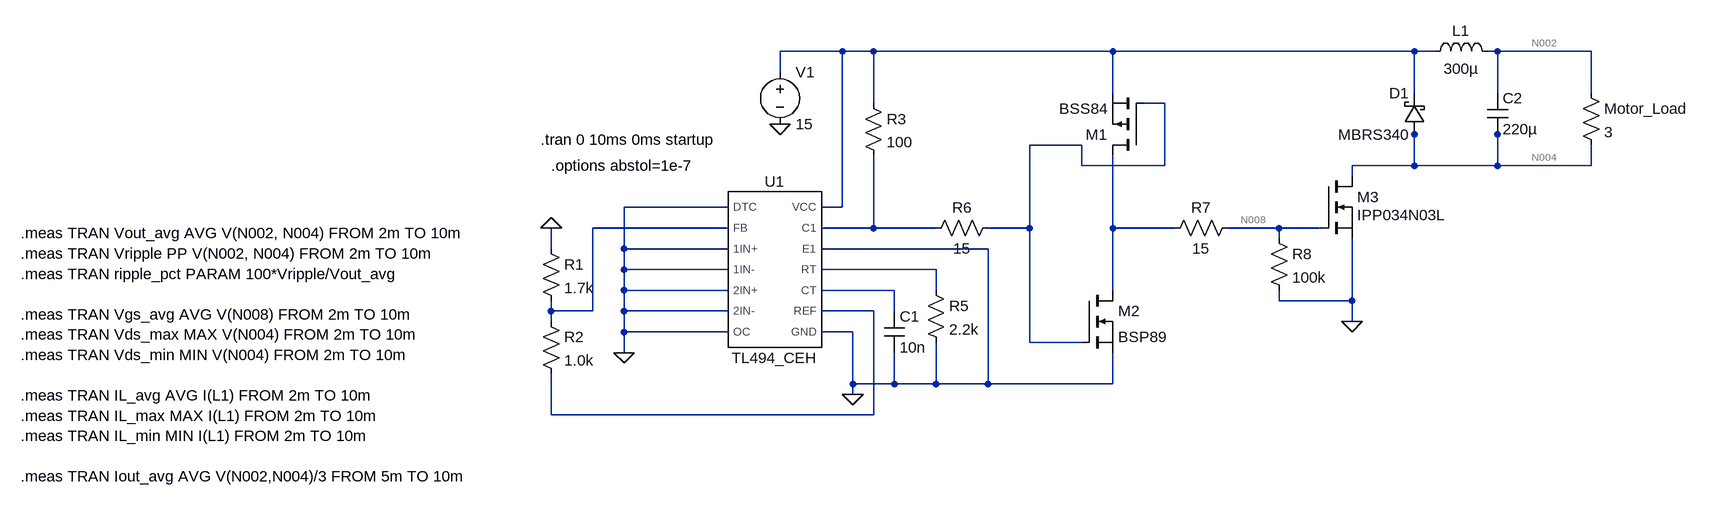
[diagram p0: schematic Solar_Car_Simulation.asc]
Solar_Car_Simulation.asc, the LTspice schematic file:
Version 4.1
SHEET 1 1684 728
WIRE 368 -224 272 -224
WIRE 416 -224 368 -224
WIRE 784 -224 416 -224
WIRE 1248 -224 784 -224
WIRE 1280 -224 1248 -224
WIRE 1376 -224 1360 -224
WIRE 1520 -224 1376 -224
WIRE 272 -192 272 -224
WIRE 784 -160 784 -224
WIRE 1248 -160 1248 -224
WIRE 1376 -160 1376 -224
WIRE 1520 -160 1520 -224
WIRE 416 -144 416 -224
WIRE 864 -144 832 -144
WIRE 1248 -96 1248 -112
WIRE 1376 -96 1376 -112
WIRE 736 -80 656 -80
WIRE 736 -48 736 -80
WIRE 864 -48 864 -144
WIRE 864 -48 736 -48
WIRE 1248 -48 1248 -96
WIRE 1248 -48 1152 -48
WIRE 1376 -48 1376 -96
WIRE 1376 -48 1248 -48
WIRE 1520 -48 1520 -80
WIRE 1520 -48 1376 -48
WIRE 1152 -32 1152 -48
WIRE 192 16 32 16
WIRE 368 16 368 -224
WIRE 368 16 336 16
WIRE 192 48 -16 48
WIRE 416 48 416 -64
WIRE 416 48 336 48
WIRE 512 48 416 48
WIRE 656 48 656 -80
WIRE 656 48 592 48
WIRE 784 48 784 -64
WIRE 880 48 784 48
WIRE 1040 48 960 48
WIRE 1104 48 1040 48
WIRE 1040 64 1040 48
WIRE -80 80 -80 48
WIRE 32 80 32 16
WIRE 192 80 32 80
WIRE 592 80 336 80
WIRE 32 112 32 80
WIRE 192 112 32 112
WIRE 512 112 336 112
WIRE 32 144 32 112
WIRE 192 144 32 144
WIRE 448 144 336 144
WIRE 512 144 512 112
WIRE 784 144 784 48
WIRE 1040 160 1040 144
WIRE 1152 160 1152 64
WIRE 1152 160 1040 160
WIRE -80 176 -80 160
WIRE -16 176 -16 48
WIRE -16 176 -80 176
WIRE 32 176 32 144
WIRE 192 176 32 176
WIRE 416 176 336 176
WIRE 448 176 448 144
WIRE -80 192 -80 176
WIRE 1152 192 1152 160
WIRE 32 208 32 176
WIRE 192 208 32 208
WIRE 384 208 336 208
WIRE 656 224 656 48
WIRE 736 224 656 224
WIRE 32 240 32 208
WIRE 384 288 384 208
WIRE 448 288 448 240
WIRE 448 288 384 288
WIRE 512 288 512 224
WIRE 512 288 448 288
WIRE 592 288 592 80
WIRE 592 288 512 288
WIRE 784 288 784 240
WIRE 784 288 592 288
WIRE 384 304 384 288
WIRE -80 336 -80 272
WIRE 416 336 416 176
WIRE 416 336 -80 336
FLAG -80 48 0
FLAG 272 -112 0
FLAG 384 304 0
FLAG 32 240 0
FLAG 1152 192 0
SYMBOL res -96 64 R0
SYMATTR InstName R1
SYMATTR Value 1.7k
SYMBOL res -96 176 R0
SYMATTR InstName R2
SYMATTR Value 1.0k
SYMBOL res 496 128 R0
SYMATTR InstName R5
SYMATTR Value 2.2k
SYMBOL cap 432 176 R0
SYMATTR InstName C1
SYMATTR Value 10n
SYMBOL voltage 272 -208 R0
WINDOW 123 0 0 Left 2
WINDOW 39 0 0 Left 2
SYMATTR InstName V1
SYMATTR Value 15
SYMBOL res 400 -160 R0
SYMATTR InstName R3
SYMATTR Value 100
SYMBOL res 608 32 R90
WINDOW 0 0 56 VBottom 2
WINDOW 3 32 56 VTop 2
SYMATTR InstName R6
SYMATTR Value 15
SYMBOL pmos 832 -64 R180
SYMATTR InstName M1
SYMATTR Value BSS84
SYMBOL nmos 736 144 R0
SYMATTR InstName M2
SYMATTR Value BSP89
SYMBOL res 976 32 R90
WINDOW 0 0 56 VBottom 2
WINDOW 3 32 56 VTop 2
SYMATTR InstName R7
SYMATTR Value 15
SYMBOL nmos 1104 -32 R0
WINDOW 3 56 60 Left 2
SYMATTR Value IPP034N03L
SYMATTR InstName M3
SYMBOL res 1024 48 R0
SYMATTR InstName R8
SYMATTR Value 100k
SYMBOL schottky 1264 -96 R180
WINDOW 0 24 64 Left 2
WINDOW 3 24 0 Left 2
SYMATTR InstName D1
SYMATTR Value MBRS340
SYMATTR Description Diode
SYMATTR Type diode
SYMBOL cap 1360 -160 R0
SYMATTR InstName C2
SYMATTR Value 220µ
SYMBOL ind 1264 -208 R270
WINDOW 0 32 56 VTop 2
WINDOW 3 5 56 VBottom 2
SYMATTR InstName L1
SYMATTR Value 300µ
SYMATTR SpiceLine Rser=1m
SYMBOL res 1504 -176 R0
SYMATTR InstName Motor_Load
SYMATTR Value 3
SYMBOL TL494_CEH 256 112 R0
SYMATTR InstName U1
TEXT -96 -88 Left 2 !.tran 0 10ms 0ms startup
TEXT -80 -48 Left 2 !.options abstol=1e-7
TEXT -896 56 Left 2 !.meas TRAN Vout_avg AVG V(N002, N004) FROM 2m TO 10m\n.meas TRAN Vripple PP V(N002, N004) FROM 2m TO 10m\n.meas TRAN ripple_pct PARAM 100*Vripple/Vout_avg\n \n.meas TRAN Vgs_avg AVG V(N008) FROM 2m TO 10m\n.meas TRAN Vds_max MAX V(N004) FROM 2m TO 10m\n.meas TRAN Vds_min MIN V(N004) FROM 2m TO 10m\n \n.meas TRAN IL_avg AVG I(L1) FROM 2m TO 10m\n.meas TRAN IL_max MAX I(L1) FROM 2m TO 10m\n.meas TRAN IL_min MIN I(L1) FROM 2m TO 10m\n \n.meas TRAN Iout_avg AVG V(N002,N004)/3 FROM 5m TO 10m

The netlist it stands for:
* Solar_Car_Simulation.asc
R1 0 N005 1.7k
R2 N005 N011 1.0k
R5 N009 0 2.2k
C1 N010 0 10n
V1 N001 0 15
R3 N001 N006 100
R6 N003 N006 15
M1 N007 N003 N001 N001 BSS84
M2 N007 N003 0 0 BSP89
R7 N008 N007 15
M3 N004 N008 0 0 IPP034N03L
R8 N008 0 100k
D1 N004 N001 MBRS340
C2 N002 N004 220µ
L1 N001 N002 300µ Rser=1m
R§Motor_Load N002 N004 3
X§U1 0 N005 0 0 0 0 0 N001 N006 0 N009 N010 N011 0 TL494_CEH  ; pins DTC FB 1IN+ 1IN- 2IN+ 2IN- OC VCC C1 E1 RT CT REF GND
.model D D
.lib standard.dio
.model NMOS NMOS
.model PMOS PMOS
.lib standard.mos
.tran 0 10ms 0ms startup
.options abstol=1e-7
.meas TRAN Vout_avg AVG V(N002, N004) FROM 2m TO 10m
.meas TRAN Vripple PP V(N002, N004) FROM 2m TO 10m
.meas TRAN ripple_pct PARAM 100*Vripple/Vout_avg
.meas TRAN Vgs_avg AVG V(N008) FROM 2m TO 10m
.meas TRAN Vds_max MAX V(N004) FROM 2m TO 10m
.meas TRAN Vds_min MIN V(N004) FROM 2m TO 10m
.meas TRAN IL_avg AVG I(L1) FROM 2m TO 10m
.meas TRAN IL_max MAX I(L1) FROM 2m TO 10m
.meas TRAN IL_min MIN I(L1) FROM 2m TO 10m
.meas TRAN Iout_avg AVG V(N002,N004)/3 FROM 5m TO 10m
.lib TL494_CEH.sub
.backanno
.end